# EAGLE design ServMon (EAGLE 5.07)
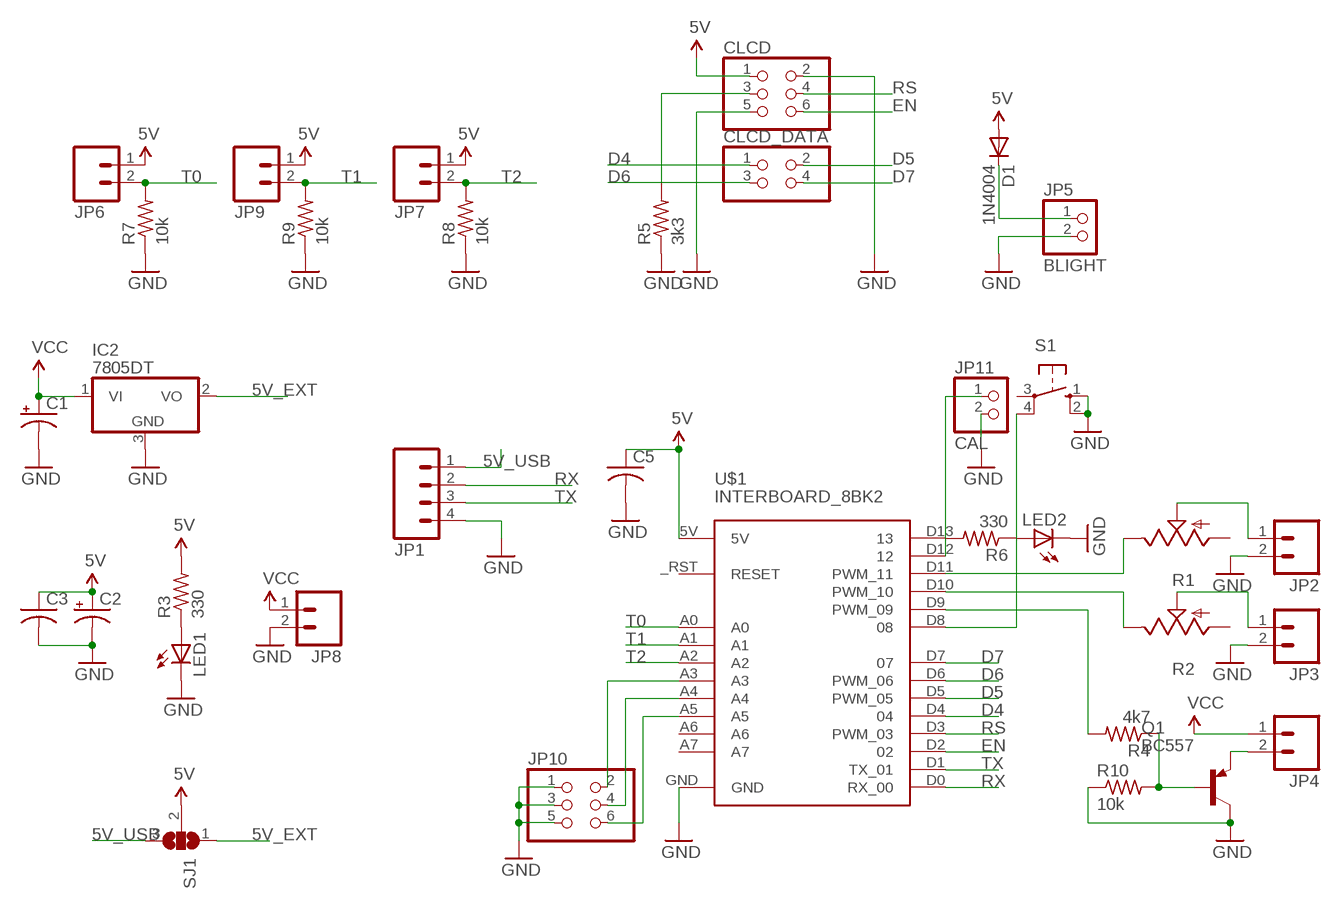
[diagram p0: schematic, sheet 1]

## Parts
C1  CPOL-USE2.5-7  [E2,5-7]
C2  CPOL-USE2.5-7  [E2,5-7]
C3  C-US050-025X075  [C050-025X075]
C5  C-US050-025X075  [C050-025X075]
CLCD  PINHD-2X3  [2X03]
CLCD_DATA  PINHD-2X2  [2X02]
D1  1N4004  [DO41-10]
IC2  7805DT  [TO252]
JP1  M04POLAR  [MOLEX-1X4]
JP2  M02POLAR  [MOLEX-1X2]
JP3  M02POLAR  [MOLEX-1X2]
JP4  M02POLAR  [MOLEX-1X2]
JP5  BLIGHT  PINHD-1X2  [1X02]
JP6  M02POLAR  [MOLEX-1X2]
JP7  M02POLAR  [MOLEX-1X2]
JP8  M02POLAR  [MOLEX-1X2]
JP9  M02POLAR  [MOLEX-1X2]
JP10  PINHD-2X3  [2X03]
JP11  CAL  PINHD-1X2  [1X02]
LED1  LED5MM  [LED5MM]
LED2  LED5MM  [LED5MM]
Q1  BC557  [TO92]
R1  TRIM_US-RS3  [RS3]
R2  TRIM_US-RS3  [RS3]
R3  330  R-US_0207/7  [0207/7]
R4  4k7  R-US_0207/7  [0207/7]
R5  3k3  R-US_0207/7  [0207/7]
R6  330  R-US_0207/7  [0207/7]
R7  10k  R-US_0207/7  [0207/7]
R8  10k  R-US_0207/7  [0207/7]
R9  10k  R-US_0207/7  [0207/7]
R10  10k  R-US_0207/7  [0207/7]
S1  10-XX  [B3F-10XX]
SJ1  SOLDERJUMPER_2WAYT  [SJ_2]
U$1  INTERBOARD_8BK2  [INTERBOARD8BK-2]

## Nets
5V: C2.+ C3.1 C5.1 CLCD.1 D1.A JP6.1 JP7.1 JP9.1 R3.2 SJ1.2 U$1.5V
5V_EXT: IC2.2(VO) SJ1.1
5V_USB: JP1.1 SJ1.3
D4: CLCD_DATA.1 U$1.D4
D5: CLCD_DATA.2 U$1.D5(PWM_05)
D6: CLCD_DATA.3 U$1.D6(PWM_06)
D7: CLCD_DATA.4 U$1.D7
EN: CLCD.6 U$1.D2
GND: C1.- C2.- C3.2 C5.2 CLCD.2 CLCD.5 IC2.3(GND) JP1.4 JP2.2 JP3.2 JP5.2 JP8.2 JP10.1 JP10.3 JP10.5 JP11.2 LED1.K(C) LED2.K(C) Q1.3(C) R5.1 R7.1 R8.1 R9.1 R10.1 S1.1(S) S1.2(S1) U$1.GND
N$1: JP4.2 Q1.1(E)
N$6: JP3.1 R2.S
N$7: JP2.1 R1.S
N$8: R1.E U$1.D11(PWM_11)
N$9: R2.E U$1.D10(PWM_10)
N$10: LED1.A R3.1
N$11: R4.2 U$1.D9(PWM_09)
N$12: Q1.2(B) R4.1 R10.2
N$13: CLCD.3 R5.2
N$14: D1.C JP5.1
N$15: LED2.A R6.1
N$16: R6.2 U$1.D13
N$18: JP10.2 U$1.A3
N$19: JP10.4 U$1.A4
N$20: JP10.6 U$1.A5
N$21: S1.4(P1) U$1.D8
N$22: JP11.1 U$1.D12
RS: CLCD.4 U$1.D3(PWM_03)
RX: JP1.2 U$1.D0(RX_00)
T0: JP6.2 R7.2 U$1.A0
T1: JP9.2 R9.2 U$1.A1
T2: JP7.2 R8.2 U$1.A2
TX: JP1.3 U$1.D1(TX_01)
VCC: C1.+ IC2.1(VI) JP4.1 JP8.1
Unconnected: R1.A R2.A S1.3(P) U$1._RST(RESET) U$1.A6 U$1.A7

## Library data of the parts
C1 C2 = rcl:CPOL-US: POLARIZED CAPACITOR, American symbol
C3 C5 = rcl:C-US: CAPACITOR, American symbol
CLCD JP10 = pinhead:PINHD-2X3: PIN HEADER
CLCD_DATA = pinhead:PINHD-2X2: PIN HEADER
D1 = diode:1N4004: DIODE general purpose rectifier, 1 A
IC2 = linear:78*: Positive VOLTAGE REGULATOR Source: http://cache.national.com/ds/LM/LM78L05.pdf http://www.fairchildsemi.com/ds/LM/LM7805.pdf
JP1 = SparkFun:M04: Header 4 Standard 4-pin 0.1" header. Use with straight break away headers (SKU : PRT-00116), right angle break away headers (PRT-00553), swiss pins (PRT-00743), machine pins (PRT-00117), and female headers (PRT-00115). Molex polarized connector foot print use with SKU : PRT-08231 with associated crimp pins and housings.
JP2-JP4 JP6-JP9 = SparkFun:M02: Header 2 Standard 2-pin 0.1" header. Use with straight break away headers (SKU : PRT-00116), right angle break away headers (PRT-00553), swiss pins (PRT-00743), machine pins (PRT-00117), and female headers (PRT-00115). Molex polarized connector foot print use with SKU : PRT-08233 with associated crimp pins and housings.
JP5 JP11 = pinhead:PINHD-1X2: PIN HEADER
LED1 LED2 = led:LED: LED OSRAM: - CHIPLED LG R971, LG N971, LY N971, LG Q971, LY Q971, LO R971, LY R971 LH N974, LH R974 LS Q976, LO Q976, LY Q976 LO Q996 - Hyper CHIPLED LW Q18S LB Q993, LB Q99A, LB R99A - SideLED LS A670, LO A670, LY A670, LG A670, LP A670 LB A673, LV A673, LT A673, LW A673 LH A674 LY A675 LS A676, LA A676, LO A676, LY A676, LW A676 LS A679, LY A679, LG A679 - Hyper Micro SIDELED® LS Y876, LA Y876, LO Y876, LY Y876 LT Y87S - SmartLED LW L88C, LW L88S LB L89C, LB L89S, LG L890 LS L89K, LO L89K, LY L89K LS L896, LA L896, LO L896, LY L896 - TOPLED LS T670, LO T670, LY T670, LG T670, LP T670 LSG T670, LSP T670, LSY T670, LOP T670, LYG T670 LG T671, LOG T671, LSG T671 LB T673, LV T673, LT T673, LW T673 LH T674 LS T676, LA T676, LO T676, LY T676, LB T676, LH T676, LSB T676, LW T676 LB T67C, LV T67C, LT T67C, LS T67K, LO T67K, LY T67K, LW E67C LS E67B, LA E67B, LO E67B, LY E67B, LB E67C, LV E67C, LT E67C LW T67C LS T679, LY T679, LG T679 LS T770, LO T770, LY T770, LG T770, LP T770 LB T773, LV T773, LT T773, LW T773 LH T774 LS E675, LA E675, LY E675, LS T675 LS T776, LA T776, LO T776, LY T776, LB T776 LHGB T686 LT T68C, LB T68C - Hyper Mini TOPLED® LB M676 - Mini TOPLED Santana® LG M470 LS M47K, LO M47K, LY M47K Source: http://www.osram.convergy.de LUXEON: - LUMILED® LXK2-PW12-R00, LXK2-PW12-S00, LXK2-PW14-U00, LXK2-PW14-V00 LXK2-PM12-R00, LXK2-PM12-S00, LXK2-PM14-U00 LXK2-PE12-Q00, LXK2-PE12-R00, LXK2-PE12-S00, LXK2-PE14-T00, LXK2-PE14-U00 LXK2-PB12-K00, LXK2-PB12-L00, LXK2-PB12-M00, LXK2-PB14-N00, LXK2-PB14-P00, LXK2-PB14-Q00 LXK2-PR12-L00, LXK2-PR12-M00, LXK2-PR14-Q00, LXK2-PR14-R00 LXK2-PD12-Q00, LXK2-PD12-R00, LXK2-PD12-S00 LXK2-PH12-R00, LXK2-PH12-S00 LXK2-PL12-P00, LXK2-PL12-Q00, LXK2-PL12-R00 Source: www.luxeon.com KINGBRIGHT: KA-3528ASYC Source: www.kingbright.com
Q1 = transistor-pnp:BC557: PNP Transistor
R1 R2 = pot:TRIM_US-: POTENTIOMETER
R3 R4 R6-R10 = rcl:R-US_: RESISTOR, American symbol
R5 = resistor:R-US_: RESISTOR, American symbol
S1 = switch-omron:10-XX: OMRON SWITCH
SJ1 = SparkFun:SOLDERJUMPER_2WAY: Solder Jumper 2 way solder jumper
U$1 = suapapa:INTERBOARD_8BK

## Board
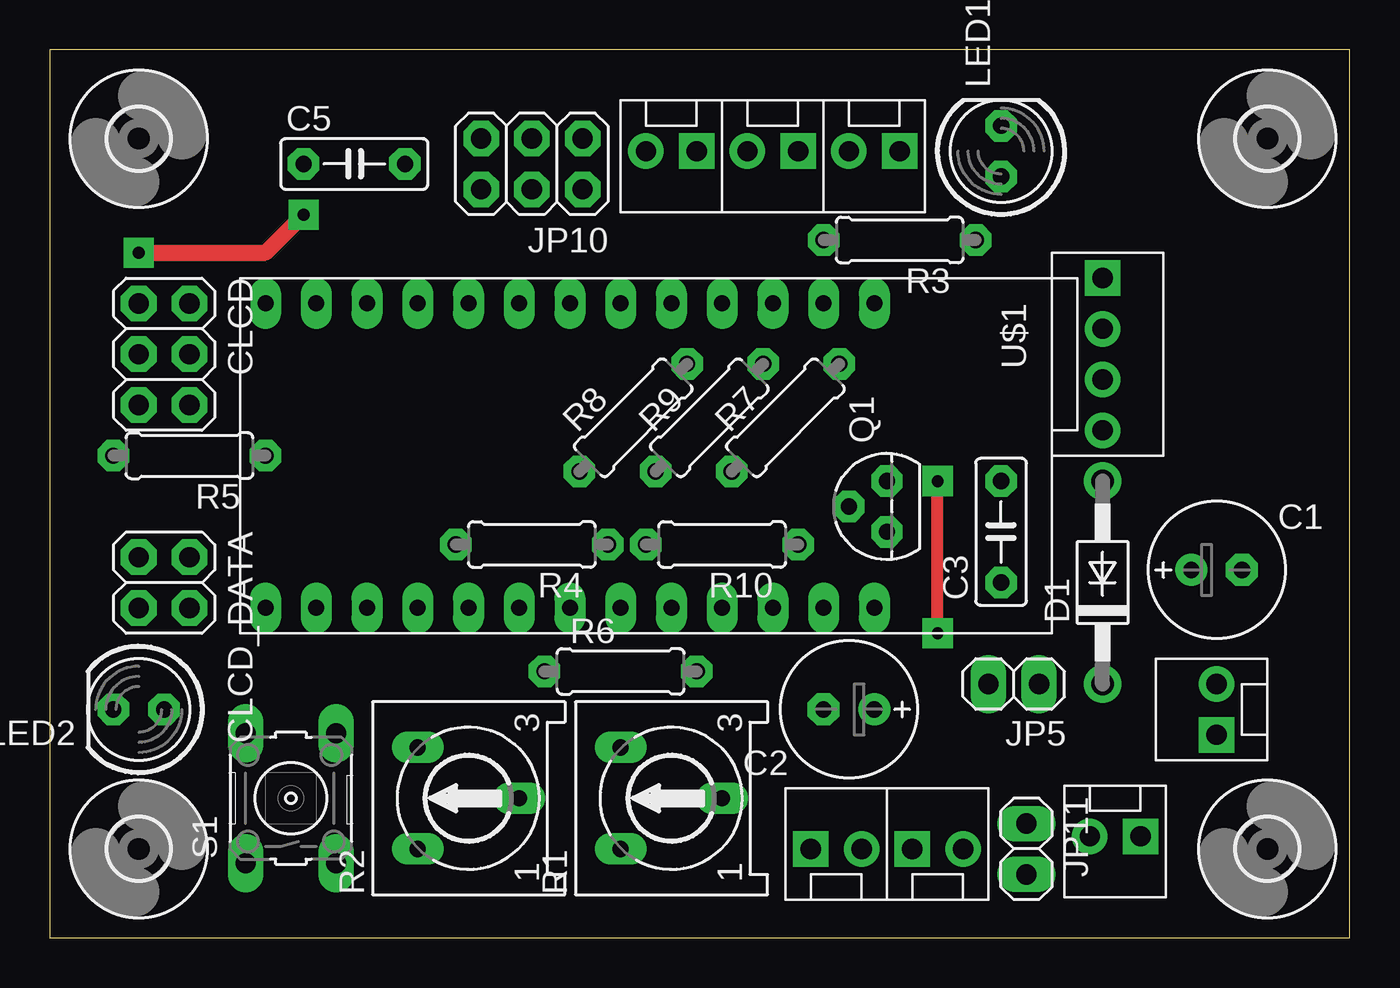
[diagram p1: board, top side]
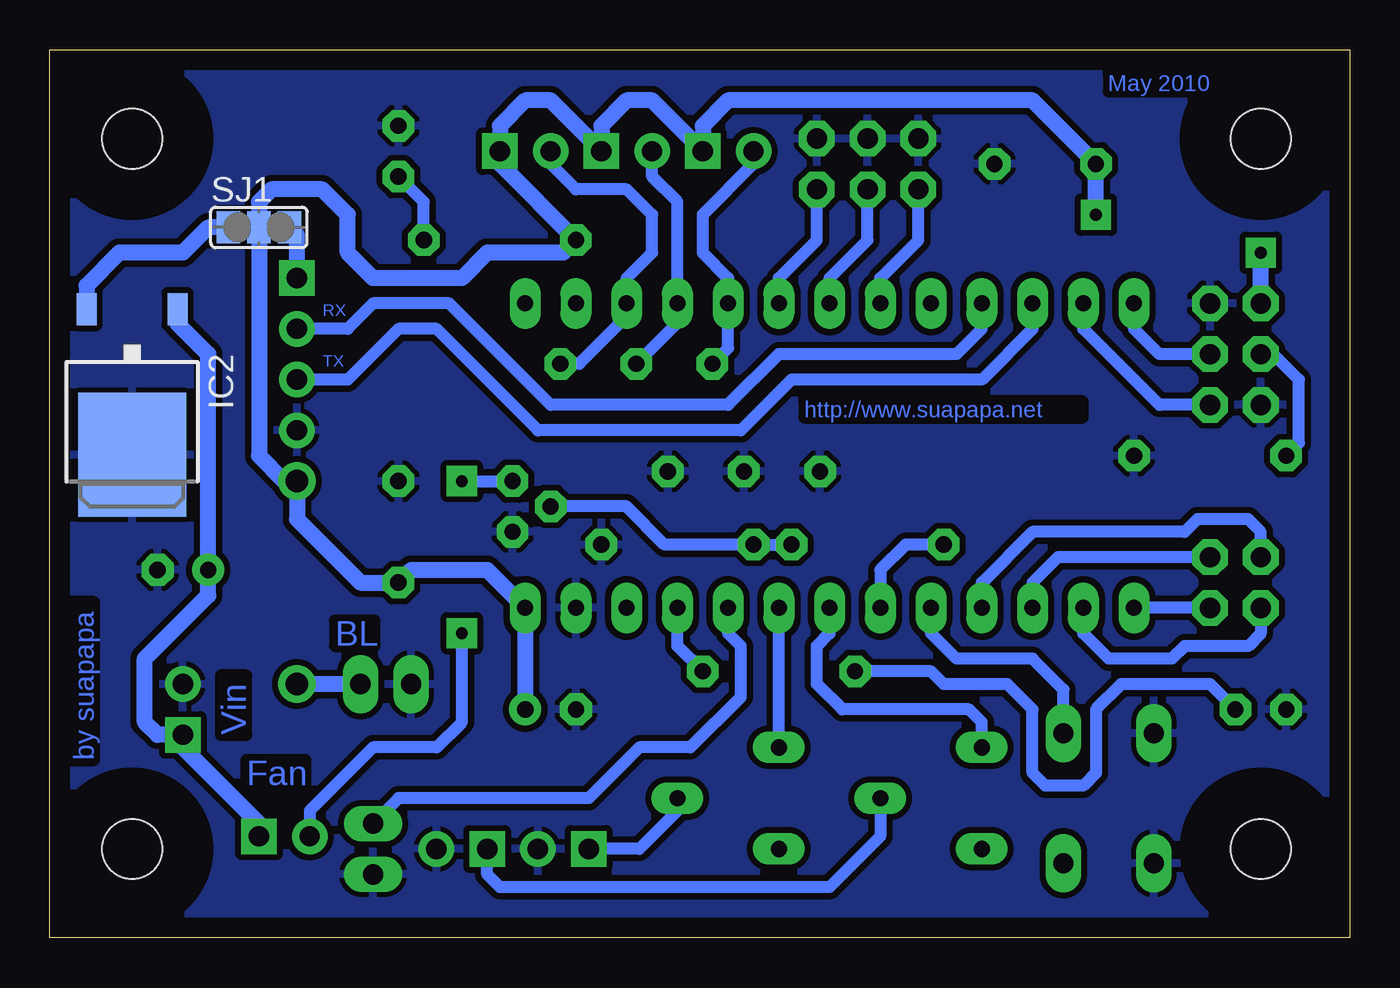
[diagram p2: board, bottom side, seen from below]

Size 65.08 x 44.44 mm. Coordinates in mm from the lower left corner, seen from the top.
Outline: 0,0 65.08,0 65.08,44.44 0,44.44 0,0
Copper layers (1*16): Top 0.035mm / dielectric 1.5mm / Bottom 0.035mm
Design rules "default *": minimum track width 10mil, minimum drill 24mil, track to track 12mil, track to pad 20mil, pad to pad 8mil, via to via 8mil, smd to smd 8mil, copper to edge 40mil, drill to drill 8mil, minimum pad ring 15mil, minimum via ring 18mil, stop-mask expansion 4mil, vias tented up to drill 0mil, thermal gap 10mil

### Footprints (pad centres in the part's own frame; a part is rotated, then mirrored left to right if it is on the bottom)
E2,5-7 = drill 0.813 pad 1.6 round: + -1.27,0 | drill 0.813 pad 1.6 octagon: - 1.27,0
C050-025X075 = drill 0.813 octagon: 1 -2.54,0; 2 2.54,0
2X03 = drill 1.016 octagon: 1 -2.54,-1.27; 2 -2.54,1.27; 3 0,-1.27; 4 0,1.27; 5 2.54,-1.27; 6 2.54,1.27
2X02 = drill 1.016 octagon: 1 -1.27,-1.27; 2 -1.27,1.27; 3 1.27,-1.27; 4 1.27,1.27
DO41-10 = drill 1.118 round: A 5.08,0; C -5.08,0
TO252 = smd 1 x 1.6: 1 -2.28,-4.8; 2 2.28,-4.8 | smd 5.4 x 6.2: 3 0,2.5
MOLEX-1X4 = drill 1.016 square: 1 0,0 | drill 1.016 round: 2 2.54,0; 3 5.08,0; 4 7.62,0
MOLEX-1X2 = drill 1.016 square: 1 0,0 | drill 1.016 round: 2 2.54,0
1X02 = drill 1.016 long: 1 -1.27,0; 2 1.27,0
LED5MM = drill 0.813 octagon: A -1.27,0; K 1.27,0
TO92 = drill 0.813 octagon: 1 1.27,0; 2 0,1.905; 3 -1.27,0
RS3 = drill 0.813 long: A -2.54,2.54; E 2.54,2.54; S 0,-2.54
0207/7 = drill 0.813 octagon: 1 -3.81,0; 2 3.81,0
B3F-10XX = drill 1.016 long: 1 -3.251,2.261; 2 3.251,2.261; 3 -3.251,-2.261; 4 3.251,-2.261
SJ_2 = smd 1.168 x 1.6: 1 -1.524,0; 2 0,0; 3 1.524,0
INTERBOARD8BK-2 = drill 0.8 long: 5V 7.62,11.43; _RST -7.62,-8.89; A0 -7.62,6.35; A1 -7.62,3.81; A2 -7.62,1.27; A3 -7.62,-1.27; A4 -7.62,-3.81; A5 -7.62,-6.35; A6 -7.62,11.43; A7 -7.62,8.89; D0 -7.62,-11.43; D1 -7.62,-13.97; D2 -7.62,-16.51; D3 -7.62,-19.05; D4 7.62,-11.43; D5 7.62,-13.97; D6 7.62,-16.51; D7 7.62,-19.05; D8 7.62,-8.89; D9 7.62,-6.35; D10 7.62,-3.81; D11 7.62,-1.27; D12 7.62,1.27; D13 7.62,3.81; GND 7.62,8.89; NC 7.62,6.35
3,0 = hole 3: 0,0

### Placement (x,y rotation side)
C1  58.42,18.41 0 top
C2  40.01,11.43 180 top
C3  47.62,20.32 90 top
C5  15.24,38.73 0 top
CLCD  5.71,29.21 270 top
CLCD_DATA  5.71,17.78 270 top
D1  52.7,17.78 90 top
IC2  60.96,26.67 180 bottom
JP1  52.7,33.02 270 top
JP2  38.1,4.45 0 top
JP3  43.18,4.45 0 top
JP4  54.61,5.08 180 top
JP5  48.26,12.7 180 top
JP6  42.55,39.37 180 top
JP7  32.38,39.37 180 top
JP8  58.42,10.16 90 top
JP9  37.47,39.37 180 top
JP10  24.13,38.73 180 top
JP11  48.9,4.45 270 top
LED1  47.62,39.37 90 top
LED2  4.45,11.43 180 top
Q1  41.91,21.59 90 top
R1  31.11,6.99 90 top
R2  20.95,6.99 90 top
R3  42.55,34.92 180 top
R4  24.13,19.68 180 top
R5  6.99,24.13 180 top
R6  28.57,13.34 0 top
R7  36.83,26.04 45 top
R8  29.21,26.04 45 top
R9  33.02,26.04 45 top
R10  33.66,19.68 180 top
S1  12.06,6.99 90 top
SJ1  54.61,35.56 0 bottom
U$1  29.84,24.13 270 top
U$11  [3,0]  4.45,4.45 0 top
U$12  [3,0]  4.45,40.01 0 top
U$13  [3,0]  60.96,40.01 0 top
U$14  [3,0]  60.96,4.45 0 top

### Tracks (layer width: path | path; a pad name or v marks a point on that pad's centre or on a via)
5V  (via drill 0.6)
  Top 0.813: v4.45,34.29 10.79,34.29 v12.7,36.2
  Bottom 0.813: CLCD.1 v4.45,34.29 | v12.7,36.2 C5.1 15.88,41.91 31.11,41.91 32.38,40.64 JP7.1 34.92,41.91 36.2,41.91 37.47,40.64 JP9.1 40.01,41.91 41.27,41.91 42.55,40.64 JP6.1 42.55,38.73 R3.2 39.37,34.29 43.18,34.29 44.45,33.02 48.9,33.02 50.16,34.29 50.16,36.2 51.44,37.47 53.98,37.47 54.61,36.83 SJ1.2 54.61,24.13 53.34,22.86 D1.A 52.7,20.95 49.53,17.78 C3.1 46.99,18.41 43.18,18.41 U$1.5V C2.+
5V_EXT
  Bottom 0.813: IC2.2 63.24,32.65 61.59,34.29 58.42,34.29 57.15,35.56 SJ1.1
5V_USB
  Bottom 0.813: JP1.1 52.7,35.18 SJ1.3
D4
  Bottom 0.61: U$1.D4 18.41,17.78 15.88,20.32 8.26,20.32 7.62,20.95 5.08,20.95 4.45,20.32 CLCD_DATA.1
D5
  Bottom 0.61: CLCD_DATA.2 14.61,19.05 15.88,17.78 U$1.D5
D6
  Bottom 0.61: CLCD_DATA.3 4.45,15.24 5.08,14.61 8.26,14.61 8.89,13.97 12.06,13.97 13.34,15.24 U$1.D6
D7
  Bottom 0.61: CLCD_DATA.4 U$1.D7
EN
  Bottom 0.61: CLCD.6 9.53,26.67 13.34,30.48 U$1.D2
GND
  pour Bottom: 0.64,43.81 64.77,43.81 64.77,0.64 0.64,0.64
N$1  (via drill 0.6)
  Top 0.61: v44.45,15.24 v44.45,22.86
  Bottom 0.61: v44.45,15.24 44.45,10.79 45.72,9.53 48.9,9.53 52.07,6.35 JP4.2 | v44.45,22.86 Q1.1
N$6
  Bottom 0.61: R2.S 23.5,5.08 26.04,2.54 42.55,2.54 43.18,3.17 JP3.1
N$7
  Bottom 0.61: R1.S 33.66,6.35 35.56,4.45 JP2.1
N$8
  Bottom 0.61: R1.E U$1.D11
N$9
  Bottom 0.61: U$1.D10 26.04,15.24 26.67,14.61 26.67,12.7 25.4,11.43 19.05,11.43 18.41,10.79 R2.E
N$10
  Bottom 0.61: R3.1 46.35,36.83 LED1.A
N$11
  Bottom 0.61: U$1.D9 23.5,18.41 22.23,19.68 R4.2
N$12
  Bottom 0.61: R4.1 R10.2 34.29,19.68 36.2,21.59 Q1.2
N$13
  Bottom 0.61: R5.2 2.54,24.77 2.54,27.94 3.81,29.21 CLCD.3
N$14
  Bottom 0.813: JP5.1 D1.C
N$15
  Bottom 0.61: LED2.A 6.99,12.7 11.43,12.7 12.7,11.43 12.7,8.26 13.34,7.62 15.24,7.62 15.88,8.26 15.88,11.43 17.14,12.7 20.32,12.7 20.95,13.34 R6.1
N$16
  Bottom 0.61: U$1.D13 33.66,14.61 R6.2
N$18
  Bottom 0.61: JP10.2 26.67,34.92 28.57,33.02 U$1.A3
N$19
  Bottom 0.61: JP10.4 24.13,34.92 26.04,33.02 U$1.A4
N$20
  Bottom 0.61: JP10.6 21.59,34.92 23.5,33.02 U$1.A5
N$21
  Bottom 0.61: S1.4 14.33,12.42 15.88,13.97 19.68,13.97 20.95,15.24 U$1.D8
N$22
  Bottom 0.61: JP11.1 47.62,6.99 38.1,6.99 35.56,9.53 33.02,9.53 30.48,12.06 30.48,14.61 31.11,15.24 U$1.D12
RS
  Bottom 0.61: CLCD.4 9.53,29.21 10.79,30.48 U$1.D3
RX
  Bottom 0.61: U$1.D0 18.41,30.48 19.68,29.21 28.57,29.21 31.11,26.67 40.01,26.67 45.09,31.75 48.9,31.75 50.16,30.48 JP1.2
T0
  Bottom 0.61: R7.2 38.58,28.73 36.2,31.11 U$1.A0 36.2,33.02 34.92,34.29 34.92,36.2 36.2,37.47 38.73,37.47 40.01,38.73 JP6.2
T1
  Bottom 0.61: JP9.2 34.92,38.1 33.66,36.83 U$1.A1 33.66,30.79 R9.2
T2
  Bottom 0.61: R8.2 31.11,29.52 U$1.A2 31.11,33.02 32.38,34.29 32.38,36.2 29.84,38.73 JP7.2
TX
  Bottom 0.61: U$1.D1 15.88,30.48 18.41,27.94 27.94,27.94 30.48,25.4 40.64,25.4 45.72,30.48 47.62,30.48 50.16,27.94 JP1.3
VCC
  Bottom 0.813: IC2.1 58.68,30.74 57.15,29.21 C1.+ 57.15,17.14 60.33,13.97 60.33,10.79 59.69,10.16 JP8.1 58.42,9.53 54.61,5.71 JP4.1

### Text on the board
Bottom: May 2010 | RX | TX | http://www.suapapa.net | BL | Vin | by suapapa | Fan